# EAGLE schematic footswitchReceiver (EAGLE 9.1.2)
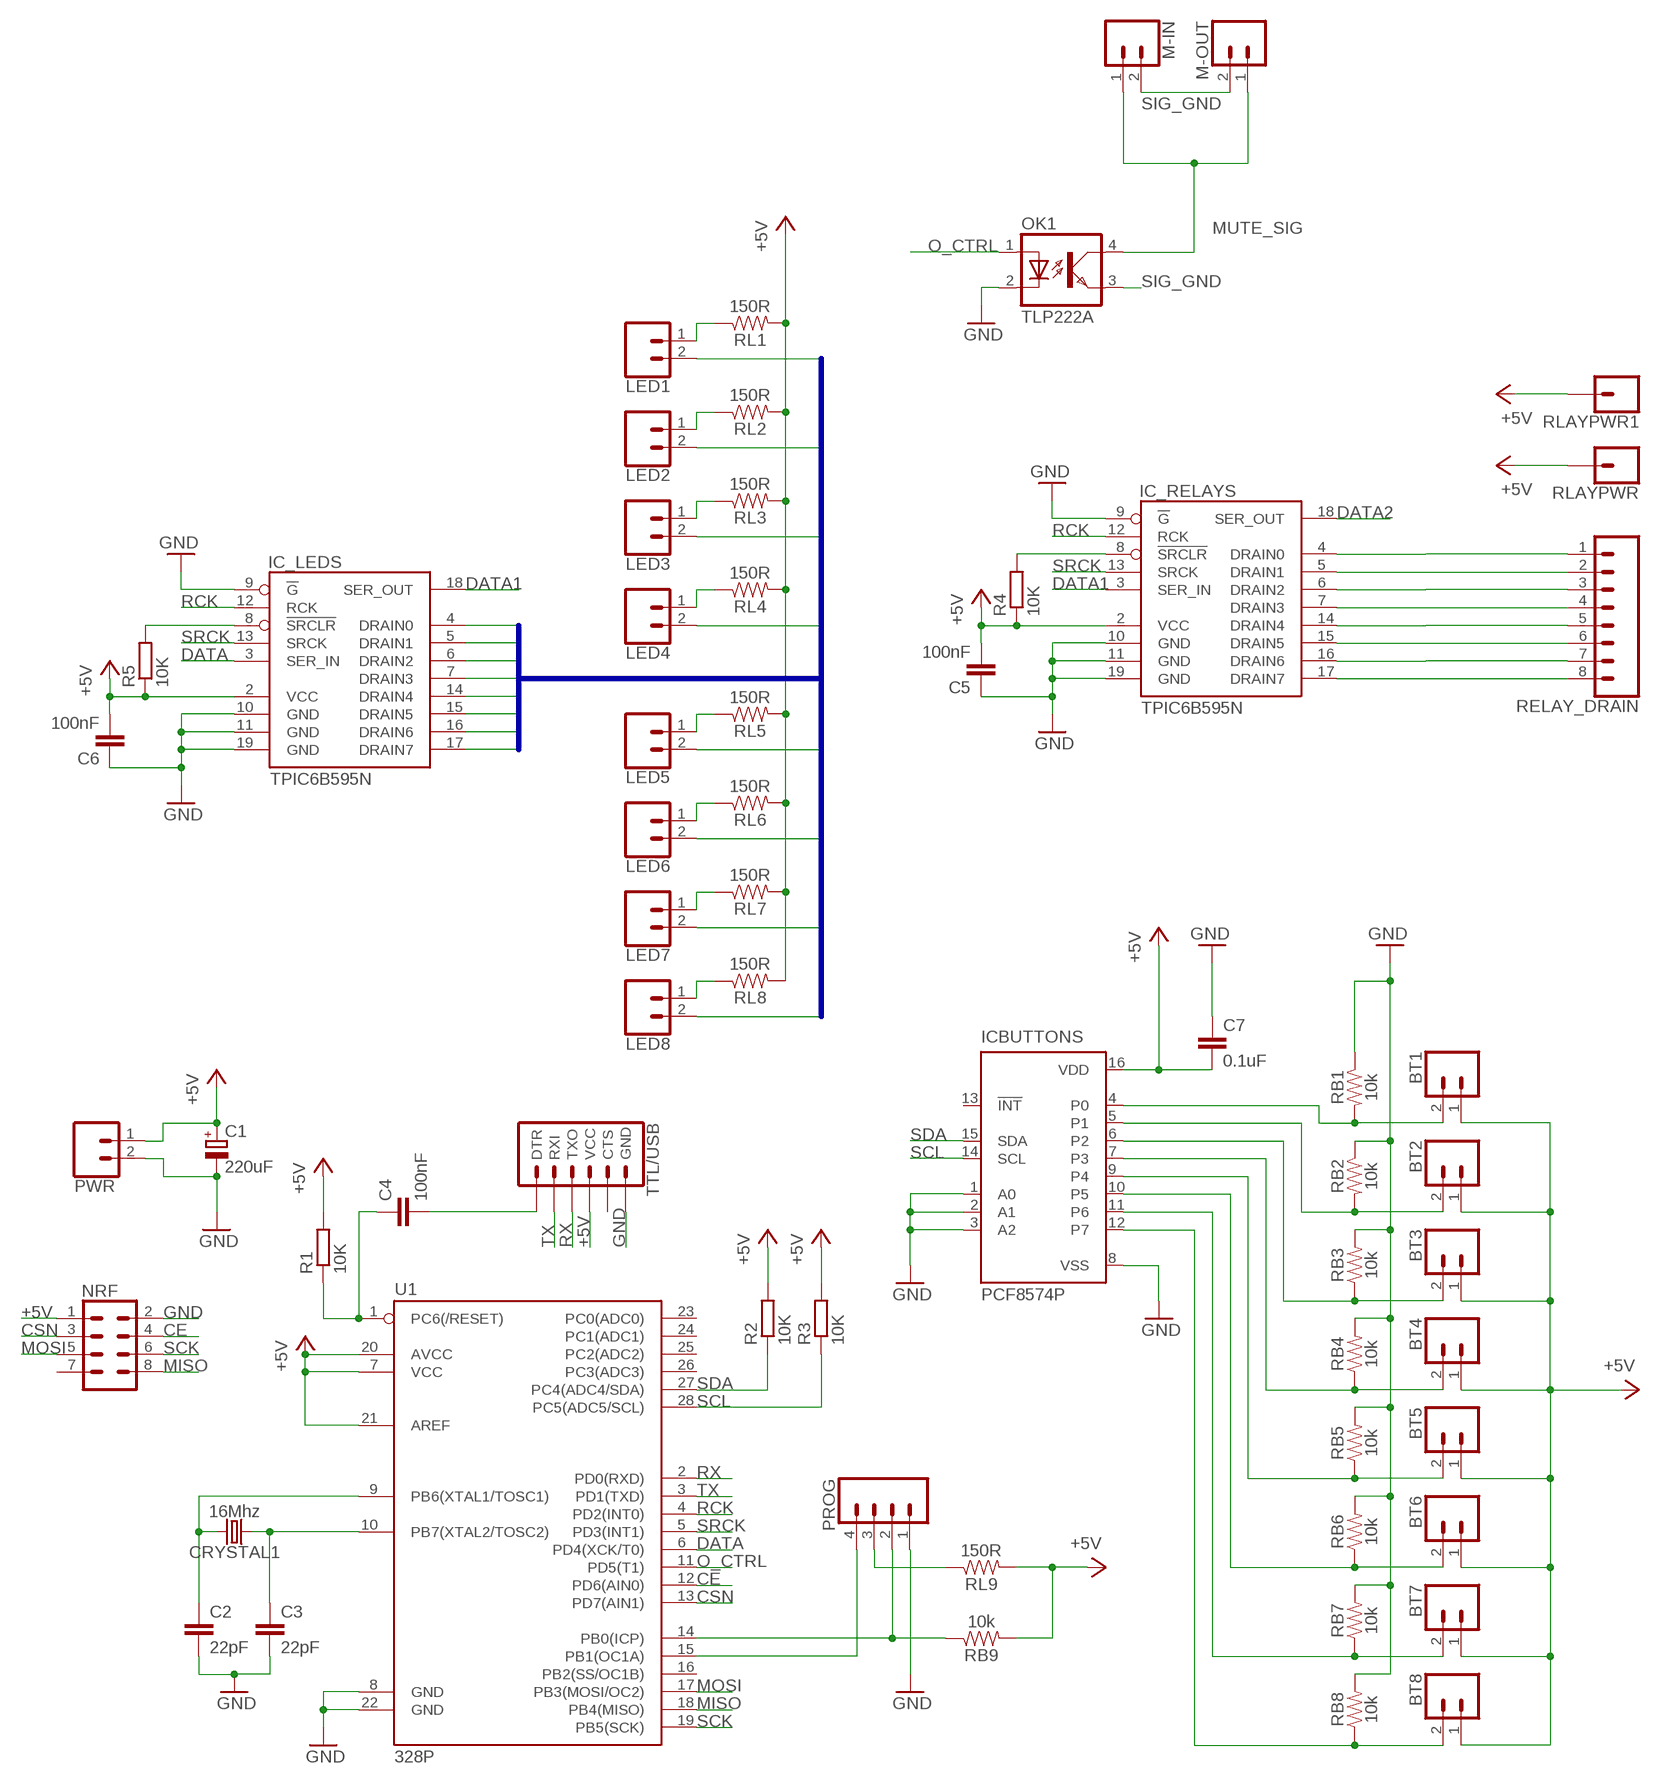
[diagram p0: schematic, sheet 1]

## Parts
BT1  CONN_02POLAR  [MOLEX-1X2]
BT2  CONN_02POLAR  [MOLEX-1X2]
BT3  CONN_02POLAR  [MOLEX-1X2]
BT4  CONN_02POLAR  [MOLEX-1X2]
BT5  CONN_02POLAR  [MOLEX-1X2]
BT6  CONN_02POLAR  [MOLEX-1X2]
BT7  CONN_02POLAR  [MOLEX-1X2]
BT8  CONN_02POLAR  [MOLEX-1X2]
C1  220uF  CPOL-EUE3.5-8  [E3,5-8]
C2  22pF  C-EU050-030X075  [C050-030X075]
C3  22pF  C-EU050-030X075  [C050-030X075]
C4  100nF  C-EU050-025X075  [C050-025X075]
C5  100nF  C-EU050-025X075  [C050-025X075]
C6  100nF  C-EU050-025X075  [C050-025X075]
C7  0.1uF  0.1UF-KIT-EZ-50V-20%  [CAP-PTH-SMALL-KIT]
CRYSTAL1  16Mhz  CRYSTALPTH-HC49US  [HC49US]
IC_LEDS  TPIC6B595N  [DIL20]
IC_RELAYS  TPIC6B595N  [DIL20]
ICBUTTONS  PCF8574P  [DIL16]
LED1  CONN_02POLAR  [MOLEX-1X2]
LED2  CONN_02POLAR  [MOLEX-1X2]
LED3  CONN_02POLAR  [MOLEX-1X2]
LED4  CONN_02POLAR  [MOLEX-1X2]
LED5  CONN_02POLAR  [MOLEX-1X2]
LED6  CONN_02POLAR  [MOLEX-1X2]
LED7  CONN_02POLAR  [MOLEX-1X2]
LED8  CONN_02POLAR  [MOLEX-1X2]
M-IN  CONN_02POLAR  [MOLEX-1X2]
M-OUT  CONN_02POLAR  [MOLEX-1X2]
NRF  CONN_04X2  [2X4]
OK1  TLP222A  PC817  [DIL04]
PROG  CONN_04  [1X04]
PWR  CONN_02  [1X02]
R1  10K  R-EU_0207/10  [0207/10]
R2  10K  R-EU_0207/10  [0207/10]
R3  10K  R-EU_0207/10  [0207/10]
R4  10K  R-EU_0207/10  [0207/10]
R5  10K  R-EU_0207/10  [0207/10]
RB1  10k  10KOHM-HORIZ-1/4W-1%  [AXIAL-0.3]
RB2  10k  10KOHM-HORIZ-1/4W-1%  [AXIAL-0.3]
RB3  10k  10KOHM-HORIZ-1/4W-1%  [AXIAL-0.3]
RB4  10k  10KOHM-HORIZ-1/4W-1%  [AXIAL-0.3]
RB5  10k  10KOHM-HORIZ-1/4W-1%  [AXIAL-0.3]
RB6  10k  10KOHM-HORIZ-1/4W-1%  [AXIAL-0.3]
RB7  10k  10KOHM-HORIZ-1/4W-1%  [AXIAL-0.3]
RB8  10k  10KOHM-HORIZ-1/4W-1%  [AXIAL-0.3]
RB9  10k  10KOHM-HORIZ-1/4W-1%  [AXIAL-0.3]
RELAY_DRAIN  CONN_08"  [1X08]
RL1  150R  10KOHM-HORIZ-1/4W-1%  [AXIAL-0.3]
RL2  150R  10KOHM-HORIZ-1/4W-1%  [AXIAL-0.3]
RL3  150R  10KOHM-HORIZ-1/4W-1%  [AXIAL-0.3]
RL4  150R  10KOHM-HORIZ-1/4W-1%  [AXIAL-0.3]
RL5  150R  10KOHM-HORIZ-1/4W-1%  [AXIAL-0.3]
RL6  150R  10KOHM-HORIZ-1/4W-1%  [AXIAL-0.3]
RL7  150R  10KOHM-HORIZ-1/4W-1%  [AXIAL-0.3]
RL8  150R  10KOHM-HORIZ-1/4W-1%  [AXIAL-0.3]
RL9  150R  10KOHM-HORIZ-1/4W-1%  [AXIAL-0.3]
RLAYPWR  CONN_01  [1X01]
RLAYPWR1  CONN_01  [1X01]
TTL/USB  6_PIN_SERIAL_TARGETPTH-KIT  [1X06-KIT]
U1  328P  ATMEGA328P_PDIP  [DIP28]

## Nets
+5V: BT1.1 BT2.1 BT3.1 BT4.1 BT5.1 BT6.1 BT7.1 BT8.1 C1.+ C5.2 C6.2 C7.2 IC_LEDS.2(VCC) IC_RELAYS.2(VCC) ICBUTTONS.16(VDD) NRF.1 PWR.1 R1.2 R2.2 R3.2 R4.1 R5.1 RB9.P$2 RL1.P$2 RL2.P$2 RL3.P$2 RL4.P$2 RL5.P$2 RL6.P$2 RL7.P$2 RL8.P$2 RL9.P$2 RLAYPWR1.1 RLAYPWR.1 TTL/USB.4(VCC) U1.7(VCC) U1.20(AVCC) U1.21(AREF)
CE: NRF.4 U1.12(PD6(AIN0))
CSN: NRF.3 U1.13(PD7(AIN1))
DATA: IC_LEDS.3(SER_IN) U1.6(PD4(XCK/T0))
DATA1: IC_LEDS.18(SER_OUT) IC_RELAYS.3(SER_IN)
DATA2: IC_RELAYS.18(SER_OUT)
GND: C1.- C2.2 C3.2 C5.1 C6.1 C7.1 IC_LEDS.9(!G) IC_LEDS.10(GND) IC_LEDS.11(GND) IC_LEDS.19(GND) IC_RELAYS.9(!G) IC_RELAYS.10(GND) IC_RELAYS.11(GND) IC_RELAYS.19(GND) ICBUTTONS.1(A0) ICBUTTONS.2(A1) ICBUTTONS.3(A2) ICBUTTONS.8(VSS) NRF.2 OK1.2(C) PROG.1 PWR.2 RB1.P$1 RB2.P$1 RB3.P$2 RB4.P$2 RB5.P$2 RB6.P$2 RB7.P$2 RB8.P$2 TTL/USB.6(GND) U1.8(GND) U1.22(GND)
L0: IC_LEDS.4(DRAIN0) LED1.2
L1: IC_LEDS.5(DRAIN1) LED2.2
L2: IC_LEDS.6(DRAIN2) LED3.2
L3: IC_LEDS.7(DRAIN3) LED4.2
L4: IC_LEDS.14(DRAIN4) LED5.2
L5: IC_LEDS.15(DRAIN5) LED6.2
L6: IC_LEDS.16(DRAIN6) LED7.2
L7: IC_LEDS.17(DRAIN7) LED8.2
MISO: NRF.8 U1.18(PB4(MISO))
MOSI: NRF.5 U1.17(PB3(MOSI/OC2))
MUTE_SIG: M-IN.1 M-OUT.1 OK1.4(COL)
N$1: IC_RELAYS.8(!SRCLR) R4.2
N$2: IC_LEDS.8(!SRCLR) R5.2
N$3: C3.1 CRYSTAL1.1 U1.10(PB7(XTAL2/TOSC2))
N$4: C4.1 R1.1 U1.1(PC6(/RESET))
N$5: C2.1 CRYSTAL1.2 U1.9(PB6(XTAL1/TOSC1))
N$6: C4.2 TTL/USB.1(DTR)
N$7: LED8.1 RL8.P$1
N$9: BT1.2 ICBUTTONS.4(P0) RB1.P$2
N$10: BT2.2 ICBUTTONS.5(P1) RB2.P$2
N$11: BT3.2 ICBUTTONS.6(P2) RB3.P$1
N$12: BT4.2 ICBUTTONS.7(P3) RB4.P$1
N$13: BT5.2 ICBUTTONS.9(P4) RB5.P$1
N$14: BT6.2 ICBUTTONS.10(P5) RB6.P$1
N$15: BT7.2 ICBUTTONS.11(P6) RB7.P$1
N$16: BT8.2 ICBUTTONS.12(P7) RB8.P$1
N$17: LED7.1 RL7.P$1
N$18: LED6.1 RL6.P$1
N$19: LED5.1 RL5.P$1
N$20: LED4.1 RL4.P$1
N$21: LED3.1 RL3.P$1
N$22: LED2.1 RL2.P$1
N$23: LED1.1 RL1.P$1
N$24: PROG.2 RB9.P$1 U1.14(PB0(ICP))
N$25: PROG.3 RL9.P$1
N$26: PROG.4 U1.15(PB1(OC1A))
O_CTRL: OK1.1(A) U1.11(PD5(T1))
RCK: IC_LEDS.12(RCK) IC_RELAYS.12(RCK) U1.4(PD2(INT0))
REL0: IC_RELAYS.4(DRAIN0) RELAY_DRAIN.1
REL1: IC_RELAYS.5(DRAIN1) RELAY_DRAIN.2
REL2: IC_RELAYS.6(DRAIN2) RELAY_DRAIN.3
REL3: IC_RELAYS.7(DRAIN3) RELAY_DRAIN.4
REL4: IC_RELAYS.14(DRAIN4) RELAY_DRAIN.5
REL5: IC_RELAYS.15(DRAIN5) RELAY_DRAIN.6
REL6: IC_RELAYS.16(DRAIN6) RELAY_DRAIN.7
REL7: IC_RELAYS.17(DRAIN7) RELAY_DRAIN.8
RX: TTL/USB.3(TXO) U1.2(PD0(RXD))
SCK: NRF.6 U1.19(PB5(SCK))
SCL: ICBUTTONS.14(SCL) R3.1 U1.28(PC5(ADC5/SCL))
SDA: ICBUTTONS.15(SDA) R2.1 U1.27(PC4(ADC4/SDA))
SIG_GND: M-IN.2 M-OUT.2 OK1.3(EMIT)
SRCK: IC_LEDS.13(SRCK) IC_RELAYS.13(SRCK) U1.5(PD3(INT1))
TX: TTL/USB.2(RXI) U1.3(PD1(TXD))
Unconnected: ICBUTTONS.13(!INT) NRF.7 TTL/USB.5(CTS) U1.16(PB2(SS/OC1B)) U1.23(PC0(ADC0)) U1.24(PC1(ADC1)) U1.25(PC2(ADC2)) U1.26(PC3(ADC3))

## Buses
L[0..7]

## Library data of the parts
BT1-BT8 LED1-LED8 M-IN M-OUT = SparkFun-Connectors:CONN_02: Multi connection point. Often used as Generic Header-pin footprint for 0.1 inch spaced/style header connections On any of the 0.1 inch spaced packages, you can populate with these: Break Away Headers - Straight <https://www.sparkfun.com/products/116> (PRT-00116) Break Away Male Headers - Right Angle <https://www.sparkfun.com/products/553> (PRT-00553) Female Headers <https://www.sparkfun.com/products/115> (PRT-00115) Break Away Headers - Machine Pin <https://www.sparkfun.com/products/117> (PRT-00117) Break Away Female Headers - Swiss Machine Pin <https://www.sparkfun.com/products/743> (PRT-00743) For SCREWTERMINALS and SPRING TERMINALS visit here: Screw Terimnals on SparkFun.com <https://www.sparkfun.com/search/results?term=Screw+Terminals> (5mm/3.5mm/2.54mm spacing) This device is also useful as a general connection point to wire up your design to another part of your project. Our various solder wires solder well into these plated through hole pads. Hook-Up Wire - Assortment (Stranded, 22 AWG) <https://www.sparkfun.com/products/11375> (PRT-11375) Hook-Up Wire - Assortment (Solid Core, 22 AWG) <https://www.sparkfun.com/products/11367> (PRT-11367) View the entire wire category on our website here <https://www.sparkfun.com/categories/141> Special notes: Molex polarized connector foot print use with: PRT-08233 with associated crimp pins and housings. 2.54_SCREWTERM for use with PRT-10571. 3.5mm Screw Terminal footprints for PRT-08084 5mm Screw Terminal footprints for use with PRT-08432; SF_ID: PRT-09918
C1 = rcl:CPOL-EU: POLARIZED CAPACITOR, European symbol; SPICEPREFIX: C
C2-C6 = rcl:C-EU: CAPACITOR, European symbol; SPICEPREFIX: C
C7 = SparkFun-Capacitors:0.1UF: 0.1µF ceramic capacitors A capacitor is a passive two-terminal electrical component used to store electrical energy temporarily in an electric field.; PROD_ID: CAP-08370
CRYSTAL1 = SparkFun-Clocks:CRYSTAL: Crystals (Generic) These are passive quartz crystals, which can be used as a clock source for a microcontroller. Crystal's are two-terminal devices. They require external "load" capacitors to generate an oscillating signal.
IC_LEDS IC_RELAYS = TPIC6B595:TPIC6B595
ICBUTTONS = micro-philips:PCF8574: I2C-Bus Remote 8-bit I/O expander http://www.semiconductors.philips.com/acrobat_download/datasheets/PCF8574_4.pdf; MPN: PCF8574PN; OC_FARNELL: 204020; OC_NEWARK: 11N8515
NRF = SparkFun-Connectors:CONN_04X2: Multi connection point. Often used as Generic Header-pin footprint for 0.1 inch spaced/style header connections On any of the 0.1 inch spaced packages, you can populate with these: Break Away Headers - Straight <https://www.sparkfun.com/products/116> (PRT-00116) Break Away Male Headers - Right Angle <https://www.sparkfun.com/products/553> (PRT-00553) Female Headers <https://www.sparkfun.com/products/115> (PRT-00115) Break Away Headers - Machine Pin <https://www.sparkfun.com/products/117> (PRT-00117) Break Away Female Headers - Swiss Machine Pin <https://www.sparkfun.com/products/743> (PRT-00743)
OK1 = optocoupler:PC817: SHARP OPTO COUPLER; MPN: PC817X4J000F; OC_FARNELL: 9707727; OC_NEWARK: 97K7059
PROG = SparkFun-Connectors:CONN_04: Multi connection point. Often used as Generic Header-pin footprint for 0.1 inch spaced/style header connections On any of the 0.1 inch spaced packages, you can populate with these: Break Away Headers - Straight <https://www.sparkfun.com/products/116> (PRT-00116) Break Away Male Headers - Right Angle <https://www.sparkfun.com/products/553> (PRT-00553) Female Headers <https://www.sparkfun.com/products/115> (PRT-00115) Break Away Headers - Machine Pin <https://www.sparkfun.com/products/117> (PRT-00117) Break Away Female Headers - Swiss Machine Pin <https://www.sparkfun.com/products/743> (PRT-00743) For SCREWTERMINALS and SPRING TERMINALS visit here: Screw Terimnals on SparkFun.com <https://www.sparkfun.com/search/results?term=Screw+Terminals> (5mm/3.5mm/2.54mm spacing) This device is also useful as a general connection point to wire up your design to another part of your project. Our various solder wires solder well into these plated through hole pads. Hook-Up Wire - Assortment (Stranded, 22 AWG) <https://www.sparkfun.com/products/11375> (PRT-11375) Hook-Up Wire - Assortment (Solid Core, 22 AWG) <https://www.sparkfun.com/products/11367> (PRT-11367) View the entire wire category on our website here <https://www.sparkfun.com/categories/141> Special notes: Molex polarized connector foot print use with SKU : PRT-08231 with associated crimp pins and housings. 1MM SMD Version SKU: PRT-10208; PROD_ID: CONN-09696
PWR = SparkFun-Connectors:CONN_02: Multi connection point. Often used as Generic Header-pin footprint for 0.1 inch spaced/style header connections On any of the 0.1 inch spaced packages, you can populate with these: Break Away Headers - Straight <https://www.sparkfun.com/products/116> (PRT-00116) Break Away Male Headers - Right Angle <https://www.sparkfun.com/products/553> (PRT-00553) Female Headers <https://www.sparkfun.com/products/115> (PRT-00115) Break Away Headers - Machine Pin <https://www.sparkfun.com/products/117> (PRT-00117) Break Away Female Headers - Swiss Machine Pin <https://www.sparkfun.com/products/743> (PRT-00743) For SCREWTERMINALS and SPRING TERMINALS visit here: Screw Terimnals on SparkFun.com <https://www.sparkfun.com/search/results?term=Screw+Terminals> (5mm/3.5mm/2.54mm spacing) This device is also useful as a general connection point to wire up your design to another part of your project. Our various solder wires solder well into these plated through hole pads. Hook-Up Wire - Assortment (Stranded, 22 AWG) <https://www.sparkfun.com/products/11375> (PRT-11375) Hook-Up Wire - Assortment (Solid Core, 22 AWG) <https://www.sparkfun.com/products/11367> (PRT-11367) View the entire wire category on our website here <https://www.sparkfun.com/categories/141> Special notes: Molex polarized connector foot print use with: PRT-08233 with associated crimp pins and housings. 2.54_SCREWTERM for use with PRT-10571. 3.5mm Screw Terminal footprints for PRT-08084 5mm Screw Terminal footprints for use with PRT-08432
R1-R5 = rcl:R-EU_: RESISTOR, European symbol; SPICEPREFIX: R
RB1-RB9 = SparkFun-Resistors:10KOHM: 10kΩ resistor A resistor is a passive two-terminal electrical component that implements electrical resistance as a circuit element. Resistors act to reduce current flow, and, at the same time, act to lower voltage levels within circuits. - Wikipedia; PROD_ID: RES-12183
RELAY_DRAIN = SparkFun-Connectors:CONN_08: Multi connection point. Often used as Generic Header-pin footprint for 0.1 inch spaced/style header connections On any of the 0.1 inch spaced packages, you can populate with these: Break Away Headers - Straight <https://www.sparkfun.com/products/116> (PRT-00116) Break Away Male Headers - Right Angle <https://www.sparkfun.com/products/553> (PRT-00553) Female Headers <https://www.sparkfun.com/products/115> (PRT-00115) Break Away Headers - Machine Pin <https://www.sparkfun.com/products/117> (PRT-00117) Break Away Female Headers - Swiss Machine Pin <https://www.sparkfun.com/products/743> (PRT-00743) Arduino Stackable Header - 8 Pin <https://www.sparkfun.com/products/9279> (PRT-09279) For SCREWTERMINALS and SPRING TERMINALS visit here: Screw Terimnals on SparkFun.com <https://www.sparkfun.com/search/results?term=Screw+Terminals> (5mm/3.5mm/2.54mm spacing) This device is also useful as a general connection point to wire up your design to another part of your project. Our various solder wires solder well into these plated through hole pads. Hook-Up Wire - Assortment (Stranded, 22 AWG) <https://www.sparkfun.com/products/11375> (PRT-11375) Hook-Up Wire - Assortment (Solid Core, 22 AWG) <https://www.sparkfun.com/products/11367> (PRT-11367) View the entire wire category on our website here <https://www.sparkfun.com/categories/141> Special notes: Molex polarized connector foot print use with SKU : PRT-08231 with associated crimp pins and housings. 1MM SMD Version SKU: PRT-10208 NOTES ON THE VARIANTS LOCK and LOCK_LONGPADS... This footprint was designed to help hold the alignment of a through-hole component (i.e. 6-pin header) while soldering it into place. You may notice that each hole has been shifted either up or down by 0.005 of an inch from it's more standard position (which is a perfectly straight line). This slight alteration caused the pins (the squares in the middle) to touch the edges of the holes. Because they are alternating, it causes a "brace" to hold the component in place. 0.005 has proven to be the perfect amount of "off-center" position when using our standard breakaway headers. Although looks a little odd when you look at the bare footprint, once you have a header in there, the alteration is very hard to notice. Also,if you push a header all the way into place, it is covered up entirely on the bottom side.; PROD_ID: CONN-08438
RL1-RL9 = SparkFun-Resistors:10KOHM: 10kΩ resistor A resistor is a passive two-terminal electrical component that implements electrical resistance as a circuit element. Resistors act to reduce current flow, and, at the same time, act to lower voltage levels within circuits. - Wikipedia; PROD_ID: RES-12183; VALUE: 10k
RLAYPWR RLAYPWR1 = SparkFun-Connectors:CONN_01: Single connection point. Often used as Generic Header-pin footprint for 0.1 inch spaced/style header connections On any of the 0.1 inch spaced packages, you can populate with these: Break Away Headers - Straight <https://www.sparkfun.com/products/116> (PRT-00116) Break Away Male Headers - Right Angle <https://www.sparkfun.com/products/553> (PRT-00553) Female Headers <https://www.sparkfun.com/products/115> (PRT-00115) Break Away Headers - Machine Pin <https://www.sparkfun.com/products/117> (PRT-00117) Break Away Female Headers - Swiss Machine Pin <https://www.sparkfun.com/products/743> (PRT-00743) This device is also useful as a general connection point to wire up your design to another part of your project. Our various solder wires solder well into these plated through hole pads. Hook-Up Wire - Assortment (Stranded, 22 AWG) <https://www.sparkfun.com/products/11375> (PRT-11375) Hook-Up Wire - Assortment (Solid Core, 22 AWG) <https://www.sparkfun.com/products/11367> (PRT-11367) View the entire wire category on our website here <https://www.sparkfun.com/categories/141> Special notes: SMTSO-256-ET is a "flush mount" nut for a 4-40 screw. We mostly use this on specialty testbeds; it is a nice way to connect hardware to your PCB at an adjustable hieght. Also note, the SNAP packages are for using a snappable style connector. We sell a baggie of snaps and they are also used on two LilyPad designs: Snap Assortment - 30 pack (male and female) <https://www.sparkfun.com/products/11347> (DEV-11347) LilyPad Arduino SimpleSnap <https://www.sparkfun.com/products/10941> (DEV-10941) LilyPad SimpleSnap Protoboard <https://www.sparkfun.com/products/10940> (DEV-10940)
TTL/USB = SparkFun-Connectors:6_PIN_SERIAL_TARGET: 6-pin header connection for use with the "FTDI BASIC" pinout - TARGET SIDE. Also known as "Arduino Serial Program Header". It is used to mate with our FTDI Basic serial programmers using the Arduino IDE. Note, this device has "TARGET" in the name. It is intended to be used on a design that contains a target micro-controller that you wish to program. The "sister" device, named "CABLE" is inteneded to be used on a design that usually lives on the end of your USB cable and prvides the converter chip (FTDI232 or FTDI231x) to commnicate serial RX/TX. You can populate with some of these: Break Away Headers - Straight <https://www.sparkfun.com/products/116> (PRT-00116) For reference (or to suit your programming needs) check out these designs: SparkFun FTDI Basic Breakout - 5V <https://www.sparkfun.com/products/9716> (DEV-09716) SparkFun FTDI Basic Breakout - 3.3V <https://www.sparkfun.com/products/9873> (DEV-09873) SparkFun FTDI SmartBasic <https://www.sparkfun.com/products/12935> (DEV-12935) SparkFun Beefy 3 - FTDI Basic Breakout <https://www.sparkfun.com/products/13746> (DEV-13746)
U1 = SparkFun-IC-Microcontroller:ATMEGA328P_PDIP: Atmel 328P Through hole ATMEGA328P uC used in the Arduino 32kb flash, 1k EEPROM, 2k SRAM Datasheet <http://www.sparkfun.com/datasheets/Components/SMD/ATMega328.pdf> SparkFun Products Storefront component: AVR 28 Pin 20MHz 32K 6A/D - ATMega328P <https://www.sparkfun.com/products/9061> (COM-09061) SparkFun Simon Says - Through-Hole Soldering Kit <https://www.sparkfun.com/products/10547> (KIT-10547) SparkFun Learn to Solder - Simon Says <https://www.sparkfun.com/products/13708> (KIT-13708) SparkFun BigTime Watch Kit <https://www.sparkfun.com/products/11734> (KIT-11734) SparkFun ClockIt <https://www.sparkfun.com/products/10930> (KIT-10930) SparkFun Serial Enabled LCD Kit <https://www.sparkfun.com/products/10097> (LCD-10097) SparkFun Simon Tilts - Through Hole Soldering Kit <https://www.sparkfun.com/products/12634> (KIT-12634) SparkFun Frequency Counter Kit <https://www.sparkfun.com/products/10140> (KIT-10140) FabFM Radio Kit <https://www.sparkfun.com/products/11043> (KIT-11043) SparkFun Binary Blaster Kit <https://www.sparkfun.com/products/12037> (KIT-12037) SparkFun Metro-Gnome <https://www.sparkfun.com/products/9236> (KIT-09236) ATmega328 with Arduino Optiboot (Uno) <https://www.sparkfun.com/products/10524> (DEV-10524); PROD_ID: IC-09136